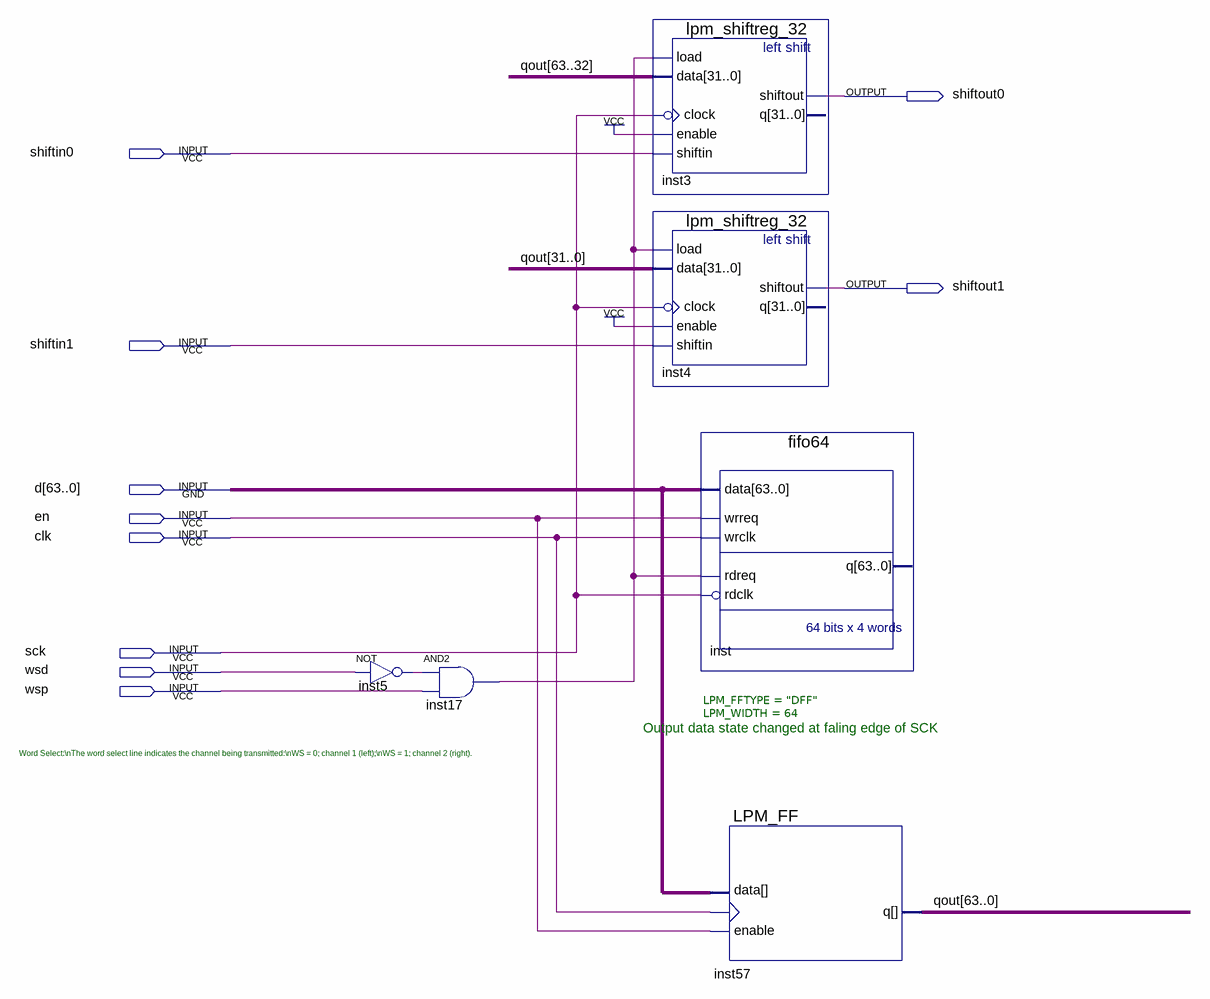
[diagram p0: schematic sheet]
// Quartus schematic 64bit_to_i2s.bdf as structural Verilog: 6 symbols, 10 pins
module \64bit_to_i2s  (
  input  shiftin0,
  input  shiftin1,
  input  [63:0] d,
  input  en,
  input  clk,
  input  sck,
  input  wsd,
  input  wsp,
  output shiftout0,
  output shiftout1
);

  wire inst5_out, inst17_out;
  wire [63:0] qout;

  not inst5 (inst5_out, wsd);
  and inst17 (inst17_out, inst5_out, wsp);
  lpm_shiftreg_32 inst3 (
    .load(inst17_out), .data(qout[63:32]), .clock(~sck), .enable(1'b1), .shiftin(shiftin0),
    .shiftout(shiftout0));  // open: q
  lpm_shiftreg_32 inst4 (
    .load(inst17_out), .data(qout[31:0]), .clock(~sck), .enable(1'b1), .shiftin(shiftin1),
    .shiftout(shiftout1));  // open: q
  fifo64 inst (.data(d), .rdclk(~sck), .rdreq(inst17_out), .wrclk(clk), .wrreq(en));  // open: q
  LPM_FF #(.LPM_FFTYPE("DFF"), .LPM_WIDTH(64)) inst57 (.clock(clk), .data(d), .enable(en), .q(qout));

  // Notes on the sheet:
  //   Output data state changed at faling edge of SCK
  //   Word Select:\nThe word select line indicates the channel being transmitted:\nWS = 0; channel 1 (left);\nWS = 1; channel 2 (right).
endmodule
